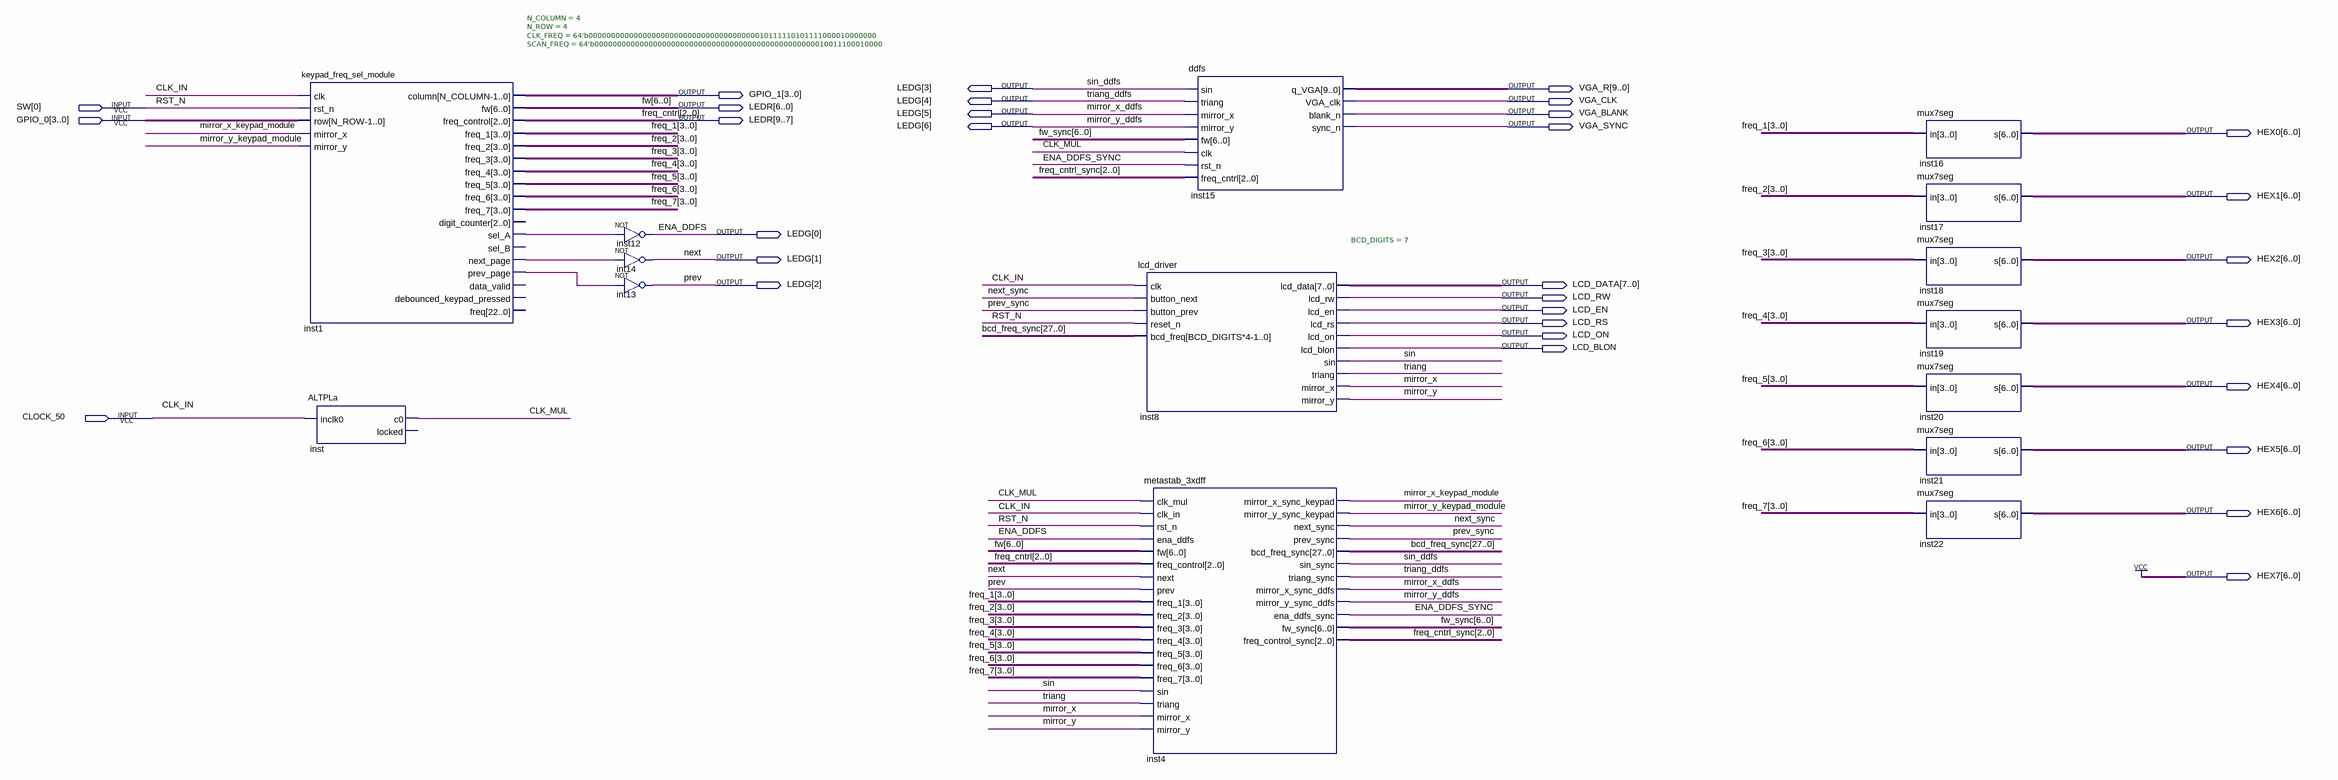
[diagram p0: schematic sheet]
// Quartus schematic main_function_generator.bdf as structural Verilog: 15 symbols, 31 pins
module main_function_generator (
  input  [0:0] SW,
  input  [3:0] GPIO_0,
  input  CLOCK_50,
  output [6:0] LEDG,
  output [9:0] VGA_R,
  output [3:0] GPIO_1,
  output VGA_CLK,
  output [9:0] LEDR,
  output VGA_BLANK,
  output VGA_SYNC,
  output [6:0] HEX0,
  output [6:0] HEX1,
  output [6:0] HEX2,
  output [7:0] LCD_DATA,
  output LCD_RW,
  output LCD_EN,
  output LCD_RS,
  output [6:0] HEX3,
  output LCD_ON,
  output LCD_BLON,
  output [6:0] HEX4,
  output [6:0] HEX5,
  output [6:0] HEX6,
  output [6:0] HEX7
);

  wire CLK_MUL, ENA_DDFS_SYNC, inst1_next_page, inst1_prev_page, inst1_sel_a, mirror_x,
       mirror_x_keypad_module, mirror_y, mirror_y_keypad_module, next_sync, prev_sync, sin, triang;
  wire [2:0] freq_cntrl_sync;
  wire [3:0] freq_1, freq_2, freq_3, freq_4, freq_5, freq_6, freq_7;
  wire [6:0] fw_sync;
  wire [27:0] bcd_freq_sync;

  keypad_freq_sel_module #(.N_COLUMN(4), .N_ROW(4), .CLK_FREQ(64'b0000000000000000000000000000000000000010111110101111000010000000), .SCAN_FREQ(64'b0000000000000000000000000000000000000000000000000010011100010000)) inst1 (
    .clk(CLOCK_50), .rst_n(SW[0]), .row(GPIO_0), .mirror_x(mirror_x_keypad_module),
    .mirror_y(mirror_y_keypad_module), .column(GPIO_1), .fw(LEDR[6:0]), .freq_control(LEDR[9:7]),
    .freq_1(freq_1), .freq_2(freq_2), .freq_3(freq_3), .freq_4(freq_4), .freq_5(freq_5), .freq_6(freq_6),
    .freq_7(freq_7), .sel_A(inst1_sel_a), .next_page(inst1_next_page), .prev_page(inst1_prev_page));  // open: digit_counter, sel_B, data_valid, debounced_keypad_pressed, freq
  ALTPLa inst (.inclk0(CLOCK_50), .c0(CLK_MUL));  // open: locked
  not inst12 (LEDG[0], inst1_sel_a);
  not int14 (LEDG[1], inst1_next_page);
  not int13 (LEDG[2], inst1_prev_page);
  lcd_driver #(.BCD_DIGITS(7)) inst8 (
    .clk(CLOCK_50), .button_next(next_sync), .button_prev(prev_sync), .reset_n(SW[0]),
    .bcd_freq(bcd_freq_sync), .lcd_data(LCD_DATA), .lcd_rw(LCD_RW), .lcd_en(LCD_EN), .lcd_rs(LCD_RS),
    .lcd_on(LCD_ON), .lcd_blon(LCD_BLON), .sin(sin), .triang(triang), .mirror_x(mirror_x), .mirror_y(mirror_y));
  metastab_3xdff inst4 (
    .clk_mul(CLK_MUL), .clk_in(CLOCK_50), .rst_n(SW[0]), .ena_ddfs(LEDG[0]), .fw(LEDR[6:0]),
    .freq_control(LEDR[9:7]), .next(LEDG[1]), .prev(LEDG[2]), .freq_1(freq_1), .freq_2(freq_2),
    .freq_3(freq_3), .freq_4(freq_4), .freq_5(freq_5), .freq_6(freq_6), .freq_7(freq_7), .sin(sin),
    .triang(triang), .mirror_x(mirror_x), .mirror_y(mirror_y), .mirror_x_sync_keypad(mirror_x_keypad_module),
    .mirror_y_sync_keypad(mirror_y_keypad_module), .next_sync(next_sync), .prev_sync(prev_sync),
    .bcd_freq_sync(bcd_freq_sync), .sin_sync(LEDG[3]), .triang_sync(LEDG[4]), .mirror_x_sync_ddfs(LEDG[5]),
    .mirror_y_sync_ddfs(LEDG[6]), .ena_ddfs_sync(ENA_DDFS_SYNC), .fw_sync(fw_sync),
    .freq_control_sync(freq_cntrl_sync));
  ddfs inst15 (
    .sin(LEDG[3]), .triang(LEDG[4]), .mirror_x(LEDG[5]), .mirror_y(LEDG[6]), .fw(fw_sync), .clk(CLK_MUL),
    .rst_n(ENA_DDFS_SYNC), .freq_cntrl(freq_cntrl_sync), .q_VGA(VGA_R), .VGA_clk(VGA_CLK),
    .blank_n(VGA_BLANK), .sync_n(VGA_SYNC));
  mux7seg inst16 (.in(freq_1), .s(HEX0));
  mux7seg inst17 (.in(freq_2), .s(HEX1));
  mux7seg inst18 (.in(freq_3), .s(HEX2));
  mux7seg inst19 (.in(freq_4), .s(HEX3));
  mux7seg inst20 (.in(freq_5), .s(HEX4));
  mux7seg inst21 (.in(freq_6), .s(HEX5));
  mux7seg inst22 (.in(freq_7), .s(HEX6));

  assign HEX7 = {7{1'b1}};

  // Other names for the same wires on the sheet: CLK_IN = CLOCK_50; ENA_DDFS = LEDG[0]; freq_cntrl[2:0] = LEDR[9:7];
  //   fw[6:0] = LEDR[6:0]; mirror_x_ddfs = LEDG[5]; mirror_y_ddfs = LEDG[6]; next = LEDG[1]; prev = LEDG[2];
  //   RST_N = SW[0]; sin_ddfs = LEDG[3]; triang_ddfs = LEDG[4]
endmodule
